# Altium schematic sheet SDCARD.SchDoc
size A4; SheetNumber: 14; SheetTotal: 15
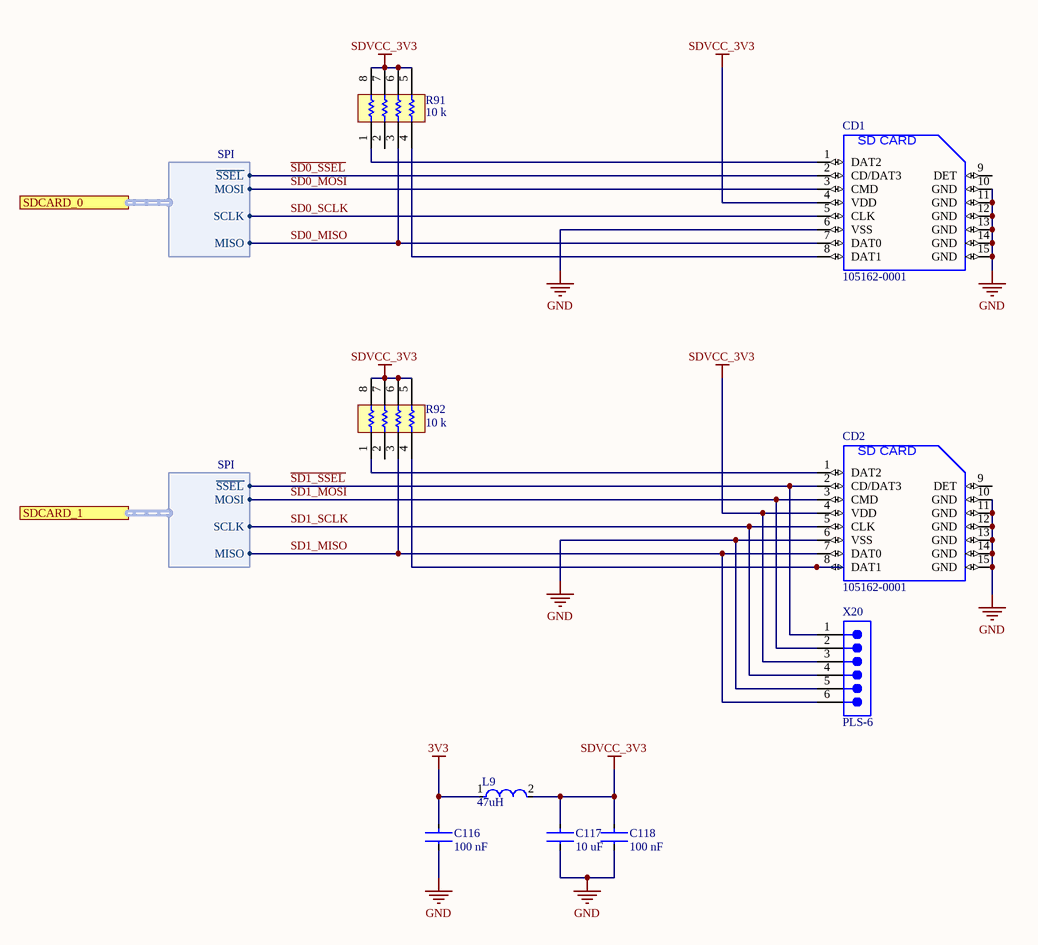
[diagram p0: SDCARD.SchDoc]

## Parts
C116  Capacitance: 100 nF  [CC0805]  (hidden comment: CC0805-1.5pF)
C117  Capacitance: 10 uF  [CC0805]  (hidden comment: CC0805-1.5pF)
C118  Capacitance: 100 nF  [CC0805]  (hidden comment: CC0805-1.5pF)
CD1  105162-0001  [105162-0001]
CD2  105162-0001  [105162-0001]
L9  Inductance: 47uH  [FP-NR6028-MFG]  (hidden comment: NR6028T470M)
R91  Resistance: 10 k  [BOUR-CAY16-J4_V]  (hidden comment: CAY16-103J4LF)
R92  Resistance: 10 k  [BOUR-CAY16-J4_V]  (hidden comment: CAY16-103J4LF)
X20  PLS-6  [SMTC-TSW-106-07-X-S]

## Ports
SDCARD_0 (harness SPI), SDCARD_1 (harness SPI)

## Harnesses
SPI: ~{SSEL}, SCLK, MOSI, MISO

## Nets
3V3: C116.1 L9.1
GND: C116.2 C117.2 C118.2 CD1.6(VSS) CD1.10(GND) CD1.11(GND) CD1.12(GND) CD1.13(GND) CD1.14(GND) CD1.15(GND) CD2.6(VSS) CD2.10(GND) CD2.11(GND) CD2.12(GND) CD2.13(GND) CD2.14(GND) CD2.15(GND) X20.5
SDVCC_3V3: C117.1 C118.1 CD1.4(VDD) CD2.4(VDD) L9.2 R91.5 R91.6 R91.7 R91.8 R92.5 R92.6 R92.7 R92.8 X20.3
~{SD0_SSEL}: CD1.2(CD/DAT3) ; port SDCARD_0.~{SSEL}
~{SD1_SSEL}: CD2.2(CD/DAT3) X20.1 ; port SDCARD_1.~{SSEL}
SD0_MISO: CD1.7(DAT0) R91.3 ; port SDCARD_0.MISO
SD0_MOSI: CD1.3(CMD) ; port SDCARD_0.MOSI
SD0_SCLK: CD1.5(CLK) ; port SDCARD_0.SCLK
SD1_MISO: CD2.7(DAT0) R92.3 X20.6 ; port SDCARD_1.MISO
SD1_MOSI: CD2.3(CMD) X20.2 ; port SDCARD_1.MOSI
SD1_SCLK: CD2.5(CLK) X20.4 ; port SDCARD_1.SCLK
NetCD1_1: CD1.1(DAT2) R91.1
NetCD1_8: CD1.8(DAT1) R91.4
NetCD2_1: CD2.1(DAT2) R92.1
NetCD2_8: CD2.8(DAT1) R92.4

Not connected (* = marked no-connect by the designer): CD1 9(DET); CD2 9(DET); R91 2; R92 2

## Notes on the sheet
- (in symbol 105162-0001) SD CARD

## Library data of the parts
C116-C118 = CC0805: CL21 Series 0805 1.5pF 50V ±0.25pF Tolerance C0G Multilayer Ceramic Chip Capacitor; Manufacturer Part Number: CL21C1R5CBANNNC; Manufacturer: Samsung; Category: Cap; value: 1.5pF; Case/Package: 0805
CD1 CD2 = 105162-0001: 9 (8 + 1) Position Card Connector microSDâ„¢ Surface Mount, Right Angle Gold; MF: Molex; Value: *; Package: None; Availability: Warning; SnapEDA_Link: https://www.snapeda.com/parts/105162-0001/Molex/view-part/481895/?ref=snap; MP: 105162-0001; Mouser-Purchase-URL: https://snapeda.com/shop?store=Mouser&id=481895; Price: None
L9 = CMP-14484-001222-1: SMD Power Inductors 47uH ±20% 0.92A 0.39Ω; Current Rating: 920mA; Test Frequency: 100kHz; Core Material: Ferrite; Self Resonant Frequency: 8MHz; Shielding: Shielded; DC Resistance (DCR): 390mR; Saturation Current: 950mA; Termination: SMD/SMT; Package Quantity: 2000; RoHS Compliant: Yes; Halogen Free: Halogen Free; Length: 0.236inch; Series: NR; Tolerance: 20%; Width: 0.236inch; Height - Seated (Max): 0.11inch; Number of Pins: 2; Mount: Surface Mount; Min Operating Temperature: -25°C; RMS Current (Irms): 920mA; Packaging: Tape and Reel; Resistor Type: Wirewound; Case/Package: 2424; Inductance Tolerance: 20%; Max Operating Temperature: 120°C; Max DC Current: 920mA; Height: 2.8mm
R91 R92 = CMP-1747-00005-1: Chip Resistor Array, 10 KOhm, +/- 5%, 62.5 mW, -55 to 125 degC, 8-Pin SMD, RoHS, Tape and Reel; Power Rating: 100 mW; Case\Package: 0603; Voltage Rating: 75 V; Tolerance: 1%; Packaging: Tape and Reel; Min Operating Temperature: -55 degC; Pins: 2; Radiation Hardening: No; DatasheetVersion: Jan-15; Length: 0.063 inch; RoHSCompliant: true; Mount: Surface Mount; ComponentLink1Description: Manufacturer URL; ComponentLink1URL: http://www.bourns.com/; Weight: 7.1E-05 oz; ComponentLink2URL: http://www.bourns.com/docs/Product-Datasheets/CATCAY.pdf; PackageReference: CAY16-J4; Width: 0.031 inch; Case Code (Imperial): 0603; Case Code (Metric): 1608; REACH SVHC: Yes; Max Operating Temperature: 155 degC; ComponentLink2Description: Datasheet; Height: 0.022 inch; PackageDescription: 8-Pin Surface Mount Device, Body 1.6 x 3.2 mm, Pitch 0.8 mm
X20 = PLS-6: 0.025" SQ Post Header, Through-hole, Vertical, -55 to 125 degC, 2.54 mm Pitch, 6-Pin, Male, RoHS; Manufacturer: Samtec; PartNumber: TSW-106-07-G-S; Pitch: 2.54 mm; value: 6 pin header 2.54mm; PackageDescription: .025[0.64] SQ. Post Terminal Strip Assembly; Manufacturer Part Number: TSW-106-07-G-S; Case/Package: PLS-6; Category: Connector